# Altium schematic sheet ALU Connector.SchDoc
size A; Author: E. Sims; Organization: Let's Build Rockets Inc.; SheetNumber: 9; SheetTotal: 11
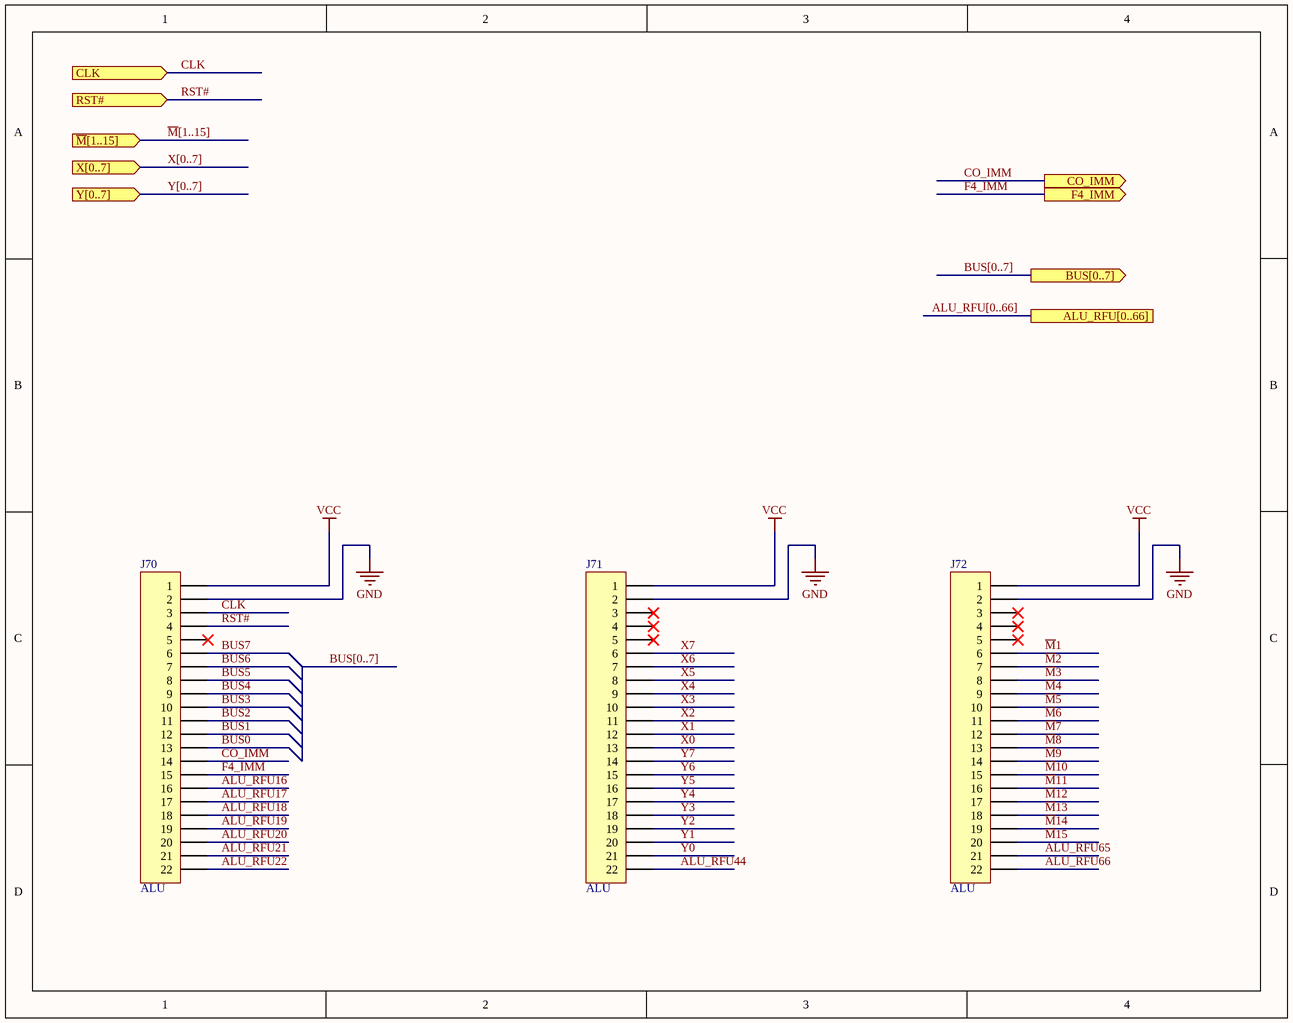
[diagram p0: ALU Connector.SchDoc]

## Parts
J70  ALU  [HDR1X22]
J71  ALU  [HDR1X22]
J72  ALU  [HDR1X22]

## Ports
ALU_RFU[0..66], BUS[0..7] (out), CLK (in), CO_IMM (out), F4_IMM (out), RST# (in), X[0..7] (in), Y[0..7] (in), ~{M}[1..15] (in)

## Nets
GND: J70.2 J71.2 J72.2
VCC: J70.1 J71.1 J72.1
ALU_RFU16: J70.16
ALU_RFU17: J70.17
ALU_RFU18: J70.18
ALU_RFU19: J70.19
ALU_RFU20: J70.20
ALU_RFU21: J70.21
ALU_RFU22: J70.22
ALU_RFU44: J71.22
ALU_RFU65: J72.21
ALU_RFU66: J72.22
BUS0: J70.13
BUS1: J70.12
BUS2: J70.11
BUS3: J70.10
BUS4: J70.9
BUS5: J70.8
BUS6: J70.7
BUS7: J70.6
CLK: J70.3 ; port CLK
CO_IMM: J70.14 ; port CO_IMM
F4_IMM: J70.15 ; port F4_IMM
~{M}1: J72.6
~{M}2: J72.7
~{M}3: J72.8
~{M}4: J72.9
~{M}5: J72.10
~{M}6: J72.11
~{M}7: J72.12
~{M}8: J72.13
~{M}9: J72.14
~{M}10: J72.15
~{M}11: J72.16
~{M}12: J72.17
~{M}13: J72.18
~{M}14: J72.19
~{M}15: J72.20
RST#: J70.4 ; port RST#
X0: J71.13
X1: J71.12
X2: J71.11
X3: J71.10
X4: J71.9
X5: J71.8
X6: J71.7
X7: J71.6
Y0: J71.21
Y1: J71.20
Y2: J71.19
Y3: J71.18
Y4: J71.17
Y5: J71.16
Y6: J71.15
Y7: J71.14

Not connected (* = marked no-connect by the designer): J70 5*; J71 3* 4* 5*; J72 3* 4* 5*

## Buses and harness runs
bus ALU_RFU[0..66] = port ALU_RFU[0..66]
bus BUS[0..7]
bus BUS[0..7] = port BUS[0..7]
bus X[0..7] = port X[0..7]
bus Y[0..7] = port Y[0..7]
bus ~{M}[1..15] = port ~{M}[1..15]

## Notes on the sheet
- Let's Build Rocket's Inc. Modular Paylaod System Based on TMP-010 Rev
  For more information visit https://github.com/LetsBuildRockets/Modular-Payload-System
  This work is licensed under CC BY-NC 4.0. To view a copy of this license, visit https://creativecommons.org/licenses/by-nc/4.0
- Title
- Size:
- Date:
- Assembly Variant:
- B
- Number:
- Time:
- Revision:
- Sheet
- of
- Author:
- File:

## Library data of the parts
J70-J72 = Header 22: Header, 22-Pin; System: Connector; LatestRevisionDate: 17-Jul-2002; LatestRevisionNote: Re-released for DXP Platform.; Publisher: Altium Limited